# Altium schematic sheet PWM.SchDoc
size A4
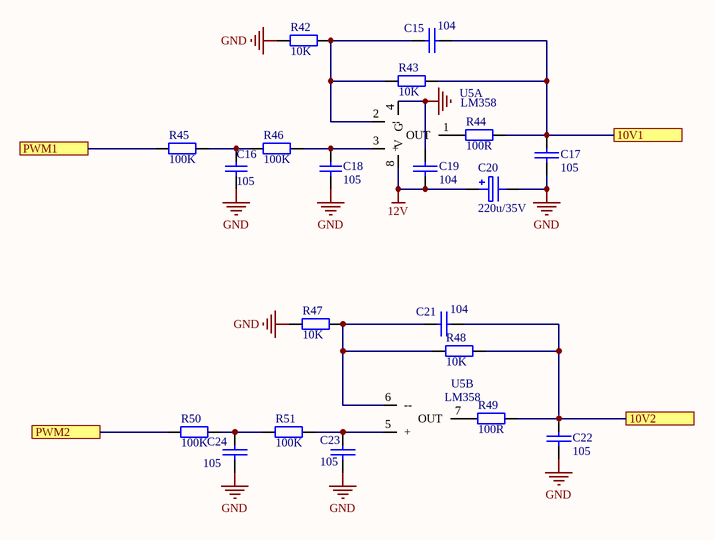
[diagram p0: PWM.SchDoc]

## Parts
C15  104  [C0805C]
C16  105  [c0805c]
C17  105  [C0805C]
C18  105  [c0805c]
C19  104  [C0805C]
C20  220u/35V  [E8MM]
C21  104  [C0805C]
C22  105  [C0805C]
C23  105  [C0805C]
C24  105  [C0805C]
R42  10K  [0805R]
R43  10K  [0805R]
R44  100R  [0805R]
R45  100K  [0805R]
R46  100K  [0805R]
R47  10K  [0805R]
R48  10K  [0805R]
R49  100R  [0805R]
R50  100K  [0805R]
R51  100K  [0805R]
U5  LM358  [SOP-08]  (parts A,B of 2)

## Ports
10V1, 10V2, PWM1, PWM2

## Nets
12V: C19.2 C20.1 U5.8(V)
GND: C16.1 C17.2 C18.1 C19.1 C20.2 C22.2 C23.2 C24.2 R42.2 R47.2 U5.4(G)
10V1: C15.2 C17.1 R43.1 R44.1 ; port 10V1
10V2: C21.2 C22.1 R48.1 R49.1 ; port 10V2
PWM1: R45.2 ; port PWM1
PWM2: R50.2 ; port PWM2
NetC15_1: C15.1 R42.1 R43.2 U5.2(--)
NetC16_2: C16.2 R45.1 R46.2
NetC18_2: C18.2 R46.1 U5.3(+)
NetC21_1: C21.1 R47.1 R48.2 U5.6(--)
NetC23_1: C23.1 R51.1 U5.5(+)
NetC24_1: C24.1 R50.1 R51.2
NetR44_2: R44.2 U5.1(OUT)
NetR49_2: R49.2 U5.7(OUT)

## Library data of the parts
C15 C19 C21 = CAP: Capacitor; 采购信息: X7R,5%,50V,贴片电容
C16 C18 = Cap: Capacitor; Value: 104; Published: 8-Jun-2000; LatestRevisionDate: 17-Jul-2002; LatestRevisionNote: Re-released for DXP Platform.; Publisher: Altium Limited
C17 C22-C24 = CAP: Capacitor; 采购信息: 1uF 25V X7R,5%,50V,贴片电容 0805
C20 = ELECTRO1: Electrolytic Capacitor; 采购信息: 1000uf/25V 插件电解电容
R42-R51 = Res2: Resistor; Value: 1K; Published: 8-Jun-2000; LatestRevisionDate: 17-Jul-2002; LatestRevisionNote: Re-released for DXP Platform.; PackageReference: AXIAL-0.4; Publisher: Altium Limited; PackageDescription: Axial Device, Thru-Hole; 2 Leads; 0.4 in Pin Spacing
U5 = LM358: 采购信息: 贴片 LM358